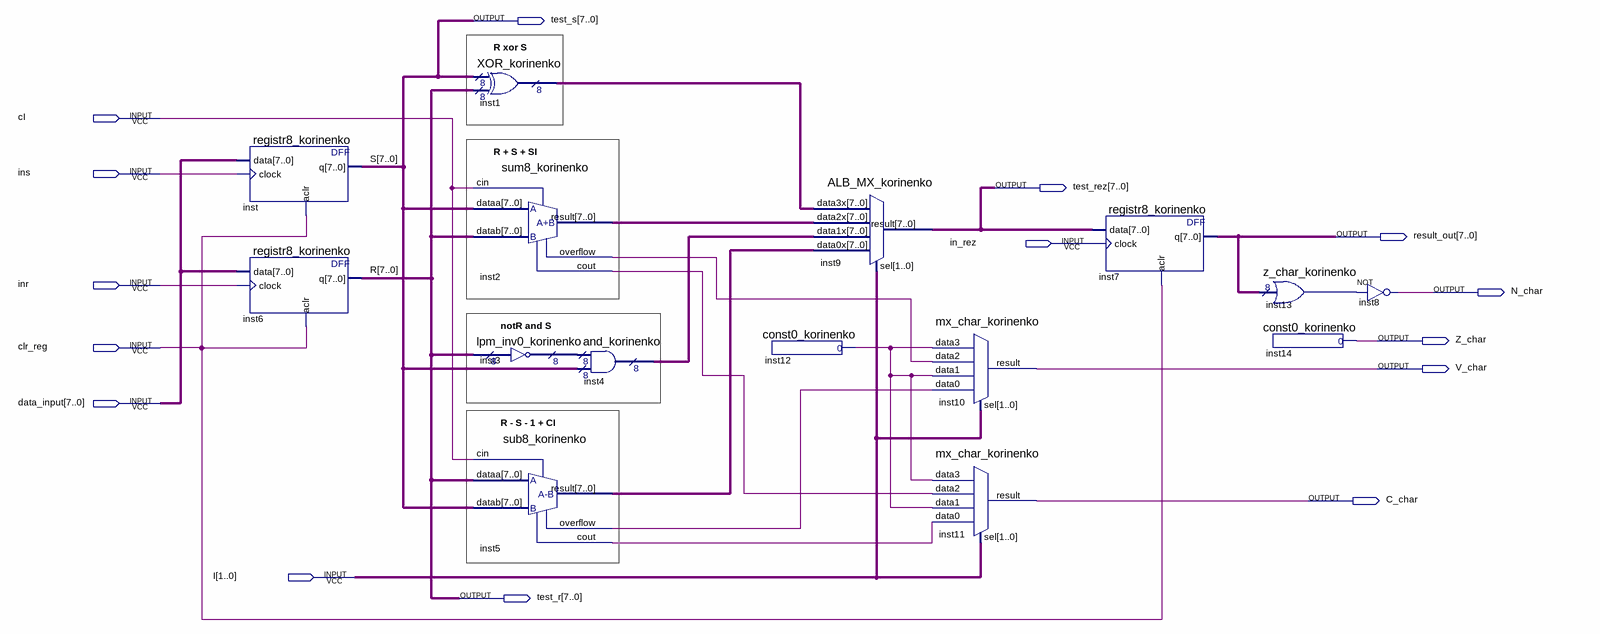
[diagram p0: schematic sheet]
// Quartus schematic Mega_korinenko_lab_ALB.bdf as structural Verilog: 15 symbols, 15 pins
module Mega_korinenko_lab_ALB (
  input  cI,
  input  ins,
  input  in_rez,
  input  inr,
  input  clr_reg,
  input  [7:0] data_input,
  input  [1:0] I,
  output [7:0] test_s,
  output [7:0] test_rez,
  output [7:0] result_out,
  output N_char,
  output Z_char,
  output V_char,
  output C_char,
  output [7:0] test_r
);

  wire inst2_cout, inst2_overflow, inst5_cout, inst5_overflow, inst12_result, inst13_result;
  wire [7:0] inst1_result, inst2_result, inst3_result, inst4_result, inst5_result;

  registr8_korinenko inst (.data(data_input), .clock(ins), .aclr(clr_reg), .q(test_s));
  registr8_korinenko inst6 (.data(data_input), .clock(inr), .aclr(clr_reg), .q(test_r));
  XOR_korinenko inst1 (.data0x(test_s), .data1x(test_r), .result(inst1_result));
  sum8_korinenko inst2 (
    .dataa(test_s), .datab(test_r), .cin(cI), .result(inst2_result), .overflow(inst2_overflow),
    .cout(inst2_cout));
  lpm_inv0_korinenko inst3 (.data(test_r), .result(inst3_result));
  sub8_korinenko inst5 (
    .dataa(test_r), .datab(test_s), .cin(cI), .result(inst5_result), .overflow(inst5_overflow),
    .cout(inst5_cout));
  and_korinenko inst4 (.data0x(inst3_result), .data1x(test_s), .result(inst4_result));
  const0_korinenko inst12 (.result(inst12_result));
  ALB_MX_korinenko inst9 (
    .data3x(inst1_result), .data2x(inst2_result), .data1x(inst4_result), .data0x(inst5_result), .sel(I),
    .result(test_rez));
  mx_char_korinenko inst10 (
    .data3(inst12_result), .data2(inst2_overflow), .data1(inst12_result), .data0(inst5_overflow), .sel(I),
    .result(V_char));
  mx_char_korinenko inst11 (
    .data3(inst12_result), .data2(inst2_cout), .data1(inst12_result), .data0(inst5_cout), .sel(I),
    .result(C_char));
  registr8_korinenko inst7 (.data(test_rez), .clock(in_rez), .aclr(clr_reg), .q(result_out));
  z_char_korinenko inst13 (.data(result_out), .result(inst13_result));
  const0_korinenko inst14 (.result(Z_char));
  not inst8 (N_char, inst13_result);

  // Other names for the same wires on the sheet: R[7:0] = test_r; S[7:0] = test_s

  // Notes on the sheet:
  //   R xor S
  //   R + S + SI
  //   notR and S
  //   R - S - 1 + CI
endmodule
